# EasyEDA Pro project Tps7A47_Tps7A33.eprj

# Schematic Schematic1
Create Date: 2024-03-18; Page Name: P1; Project Name: Tps7A47_Tps7A33; Schematic Name: Schematic1; Update Date: 2024-03-27; Company: CUIT; Drawed: lcx; Page Size: A3; Version: V1.0
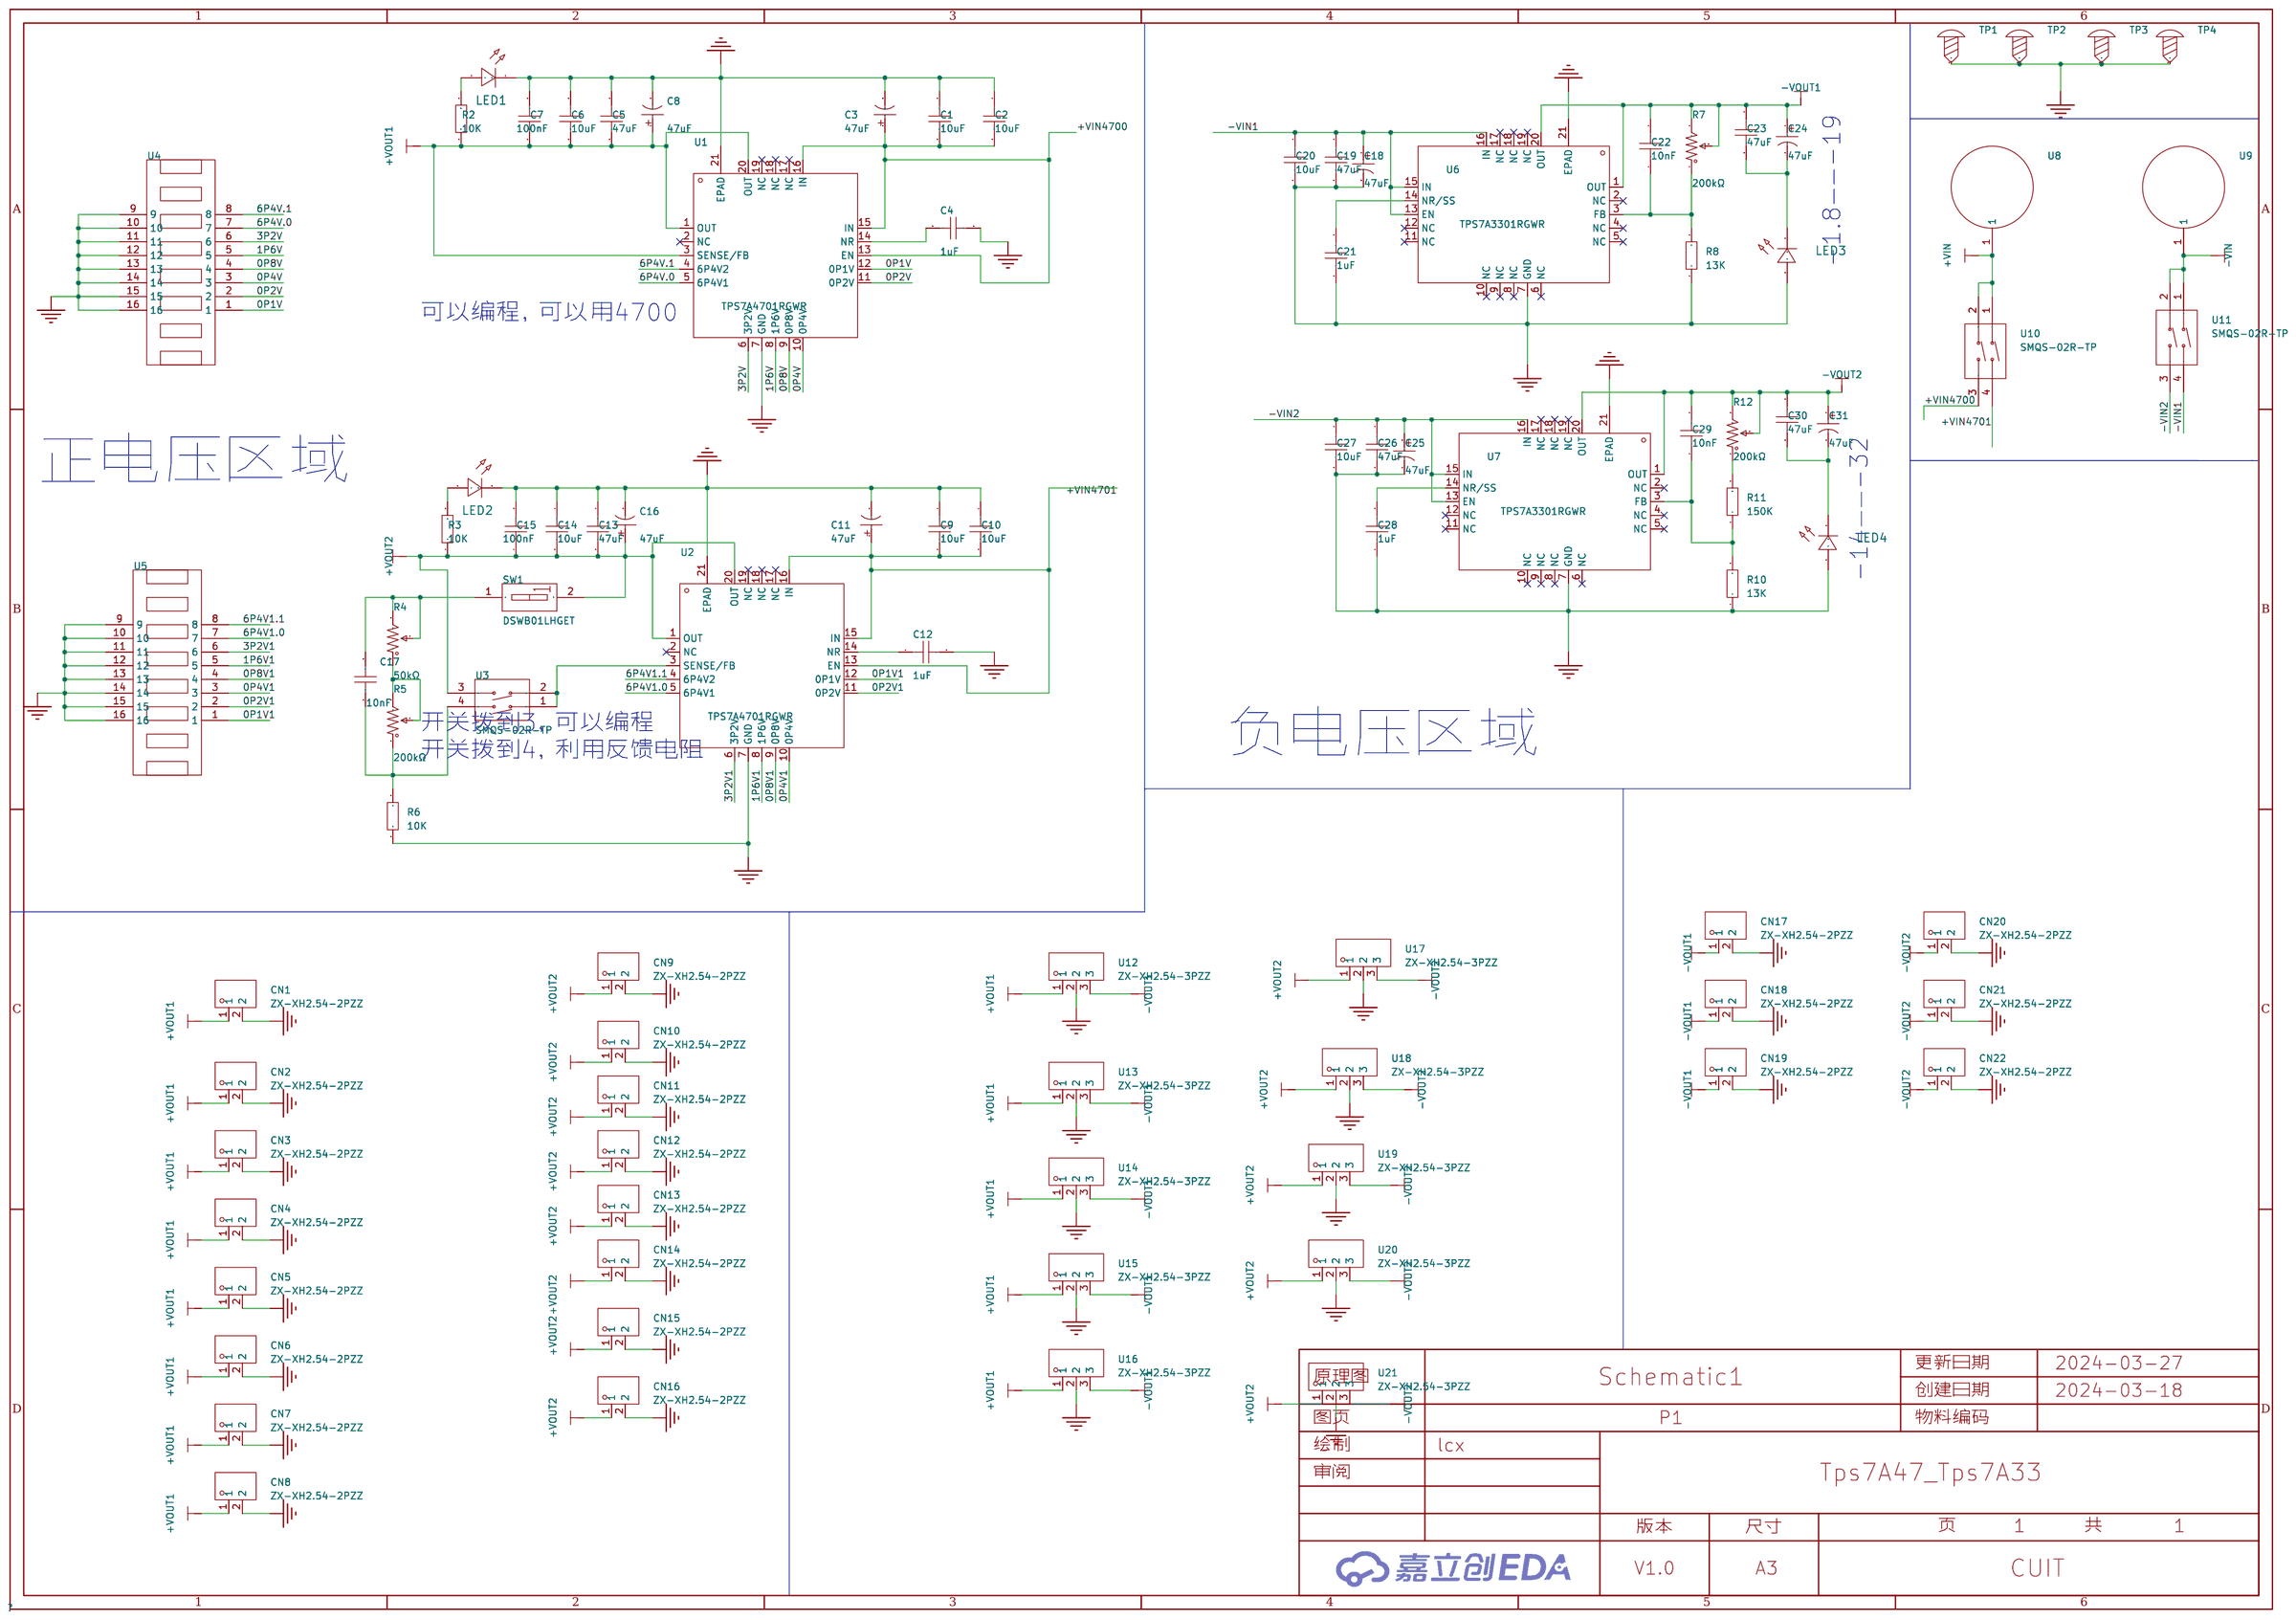
[diagram p0: schematic sheet]

## Parts
C1  10uF  [C1206]
C2  10uF  [C1206]
C3  47uF  [CAP-SMD_BD6.3-L6.6-W6.6-LS7.6-FD]
C4  1uF  [C1206]
C5  47uF  [C1206]
C6  10uF  [C1206]
C7  100nF  [C0805]
C8  47uF  [CAP-SMD_BD6.3-L6.6-W6.6-LS7.6-FD]
C9  10uF  [C1206]
C10  10uF  [C1206]
C11  47uF  [CAP-SMD_BD6.3-L6.6-W6.6-LS7.6-FD]
C12  1uF  [C1206]
C13  47uF  [C1206]
C14  10uF  [C1206]
C15  100nF  [C0805]
C16  47uF  [CAP-SMD_BD6.3-L6.6-W6.6-LS7.6-FD]
C17  10nF  [C0805]
C18  47uF  [CAP-SMD_BD6.3-L6.6-W6.6-LS7.6-FD]
C19  47uF  [C1206]
C20  10uF  [C1206]
C21  1uF  [C1206]
C22  10nF  [C0805]
C23  47uF  [C1206]
C24  47uF  [CAP-SMD_BD6.3-L6.6-W6.6-LS7.6-FD]
C25  47uF  [CAP-SMD_BD6.3-L6.6-W6.6-LS7.6-FD]
C26  47uF  [C1206]
C27  10uF  [C1206]
C28  1uF  [C1206]
C29  10nF  [C0805]
C30  47uF  [C1206]
C31  47uF  [CAP-SMD_BD6.3-L6.6-W6.6-LS7.6-FD]
CN1  ZX-XH2.54-2PZZ  [CONN-TH_2P-P2.50_HX25003-2A]
CN2  ZX-XH2.54-2PZZ  [CONN-TH_2P-P2.50_HX25003-2A]
CN3  ZX-XH2.54-2PZZ  [CONN-TH_2P-P2.50_HX25003-2A]
CN4  ZX-XH2.54-2PZZ  [CONN-TH_2P-P2.50_HX25003-2A]
CN5  ZX-XH2.54-2PZZ  [CONN-TH_2P-P2.50_HX25003-2A]
CN6  ZX-XH2.54-2PZZ  [CONN-TH_2P-P2.50_HX25003-2A]
CN7  ZX-XH2.54-2PZZ  [CONN-TH_2P-P2.50_HX25003-2A]
CN8  ZX-XH2.54-2PZZ  [CONN-TH_2P-P2.50_HX25003-2A]
CN9  ZX-XH2.54-2PZZ  [CONN-TH_2P-P2.50_HX25003-2A]
CN10  ZX-XH2.54-2PZZ  [CONN-TH_2P-P2.50_HX25003-2A]
CN11  ZX-XH2.54-2PZZ  [CONN-TH_2P-P2.50_HX25003-2A]
CN12  ZX-XH2.54-2PZZ  [CONN-TH_2P-P2.50_HX25003-2A]
CN13  ZX-XH2.54-2PZZ  [CONN-TH_2P-P2.50_HX25003-2A]
CN14  ZX-XH2.54-2PZZ  [CONN-TH_2P-P2.50_HX25003-2A]
CN15  ZX-XH2.54-2PZZ  [CONN-TH_2P-P2.50_HX25003-2A]
CN16  ZX-XH2.54-2PZZ  [CONN-TH_2P-P2.50_HX25003-2A]
CN17  ZX-XH2.54-2PZZ  [CONN-TH_2P-P2.50_HX25003-2A]
CN18  ZX-XH2.54-2PZZ  [CONN-TH_2P-P2.50_HX25003-2A]
CN19  ZX-XH2.54-2PZZ  [CONN-TH_2P-P2.50_HX25003-2A]
CN20  ZX-XH2.54-2PZZ  [CONN-TH_2P-P2.50_HX25003-2A]
CN21  ZX-XH2.54-2PZZ  [CONN-TH_2P-P2.50_HX25003-2A]
CN22  ZX-XH2.54-2PZZ  [CONN-TH_2P-P2.50_HX25003-2A]
LED1  -  [LED_0805]
LED2  -  [LED_0805]
LED3  -  [LED_0805]
LED4  -  [LED_0805]
R2  10K  [R0805]
R3  10K  [R0805]
R4  50kΩ  [RES-ADJ-TH_3P-L10.0-W10.0-P2.50-L]
R5  200kΩ  [RES-ADJ-TH_3P-L10.0-W10.0-P2.50-L]
R6  10K  [R0805]
R7  200kΩ  [RES-ADJ-TH_3P-L10.0-W10.0-P2.50-L]
R8  13K  [R0805]
R10  13K  [R0805]
R11  150K  [R0805]
R12  200kΩ  [RES-ADJ-TH_3P-L10.0-W10.0-P2.50-L]
SW1  DSWB01LHGET  [SW-TH_DSWB01LHGET]
TP1  -  [M2螺丝]
TP2  -  [M2螺丝]
TP3  -  [M2螺丝]
TP4  -  [M2螺丝]
U1  TPS7A4701RGWR  [VQFN-20_L5.0-W5.0-P0.65-TL-EP]
U2  TPS7A4701RGWR  [VQFN-20_L5.0-W5.0-P0.65-TL-EP]
U3  SMQS-02R-TP  [SW-TH_4P-L9.9-W6.8-P7.62-BL]
U4  -  [DIP16]
U5  -  [DIP16]
U6  TPS7A3301RGWR  [VQFN-20_L5.0-W5.0-P0.65-TL-EP]
U7  TPS7A3301RGWR  [VQFN-20_L5.0-W5.0-P0.65-TL-EP]
U8  -  [插座]
U9  -  [插座]
U10  SMQS-02R-TP  [SW-TH_4P-L9.9-W6.8-P7.62-BL]
U11  SMQS-02R-TP  [SW-TH_4P-L9.9-W6.8-P7.62-BL]
U12  ZX-XH2.54-3PZZ  [CONN-TH_3P-P2.54_2501S-3P]
U13  ZX-XH2.54-3PZZ  [CONN-TH_3P-P2.54_2501S-3P]
U14  ZX-XH2.54-3PZZ  [CONN-TH_3P-P2.54_2501S-3P]
U15  ZX-XH2.54-3PZZ  [CONN-TH_3P-P2.54_2501S-3P]
U16  ZX-XH2.54-3PZZ  [CONN-TH_3P-P2.54_2501S-3P]
U17  ZX-XH2.54-3PZZ  [CONN-TH_3P-P2.54_2501S-3P]
U18  ZX-XH2.54-3PZZ  [CONN-TH_3P-P2.54_2501S-3P]
U19  ZX-XH2.54-3PZZ  [CONN-TH_3P-P2.54_2501S-3P]
U20  ZX-XH2.54-3PZZ  [CONN-TH_3P-P2.54_2501S-3P]
U21  ZX-XH2.54-3PZZ  [CONN-TH_3P-P2.54_2501S-3P]

## Library data of the parts
C1 C2 C4-C6 C9 C10 C12-C14 C19-C21 C23 C26-C28 C30 = CAP_1206: Supplier Footprint: 1206
C3 C8 C11 C16 C18 C24 C25 C31 = RVT1H470M0607_C72523: 容值:47uF;精度:±20%;额定电压:50V;纹波电流:66mA@120Hz;等效串联电阻:-;; LCSC Part Name: 47uF ±20% 50V; Supplier Part: C72523; Manufacturer: ROQANG(容强); Manufacturer Part: RVT1H470M0607; Supplier Footprint: SMD,D6.3xL7.7mm; JLCPCB Part Class: 扩展库; Datasheet: https://atta.szlcsc.com/upload/public/pdf/source/20170325/1490427950282.pdf; Supplier: LCSC; Tolerance: ±20%; Rated Voltage: 50V; Ripple Current: 66mA@120Hz; φD: 6.3mm; L: 7.7mm; Lifetime @ Temp: 2000hrs@105℃; Operating Temperature: -40℃~+105℃
C7 C15 C17 C22 C29 = CAP_0805: Supplier Footprint: 0805
CN1-CN22 = ZX-XH2.54-2PZZ: 插针结构:1x2P;间距:2.54mm;安装方式:直插;参考系列:XH;总PIN数:2P;排数:1;每排PIN数:2;行距:-;额定电流:3A;触头材质:黄铜;触头镀层:锡;工作温度范围:-25℃~+85℃;; Supplier Part: C7429632; Manufacturer: Megastar(兆星); Supplier Footprint: 插件,P=2.54mm; JLCPCB Part Class: 扩展库; Datasheet: https://atta.szlcsc.com/upload/public/pdf/source/20230619/19BA6947230AA44A04D3EDD65E618FD0.pdf; Supplier: LCSC; Pins Structure: 1x2P; Pitch: 2.54mm; Mounting Style: 直插; Reference Series: XH; Number of Pins: 2P; Number of Rows: 1; Number of PINs Per Row: 2; Current Rating (Max): 3A; Contact Material: 黄铜; Contact Plating: 锡; Operating Temperature Range: -25℃~+85℃
LED1-LED4 = LED_0805-R: Supplier Footprint: 0805
R2 R3 R6 R8 R10 R11 = Res_0805: Supplier Footprint: 0805
R4 R5 R7 R12 = 3296W-1-103: 阻值:10kΩ;精度:±10%;; LCSC Part Name: 10kΩ ±10%; Supplier Part: C118954; Manufacturer: BOCHEN(博晨); Supplier Footprint: 插件; JLCPCB Part Class: 扩展库; Datasheet: https://atta.szlcsc.com/upload/public/pdf/source/20171114/C118954_15106326646611117443.pdf; Supplier: LCSC; Tolerance: ±10%
SW1 = DSWB01LHGET: 类型:平拨,凸起式;电路结构:单刀单掷;开关位数:1位;使用寿命:-;颜色:红色;; LCSC Part Name: 红色宽体1位顶拨插件; Supplier Part: C126888; Manufacturer: YE; Supplier Footprint: 插件; JLCPCB Part Class: Extended Part; Datasheet: https://atta.szlcsc.com/upload/public/pdf/source/20230725/F7B8293913D6FA08E6AB3369271AF82D.pdf; Supplier: LCSC; Type: 平拨,凸起式; Circuit: 单刀单掷; Number of Positions: 1位; Color: 红色
TP1-TP4 = M2螺丝: Supplier Footprint: 插件
U1 U2 = TPS7A4701RGWR: 输出类型:可调;最大输入电压:35V;输出电压:1.4V~34V;最大输出电流:1A;电源纹波抑制比(PSRR):78dB@(1kHz);输出极性:正极;; LCSC Part Name: ADJ 输入35V 输出1.4V~34V 1A; Supplier Part: C90084; Manufacturer: TI(德州仪器); Supplier Footprint: VQFN-20-EP(5x5); JLCPCB Part Class: Extended Part; Datasheet: https://www.ti.com/cn/lit/gpn/tps7a47; Supplier: LCSC; Output Type: 可调; Maximum Input Voltage: 35V; Output Voltage: 1.4V~34V; MAX Output Current: 1A; Power Supply Rejection Ratio (PSRR): 78dB@(1kHz); Dropout Voltage: 450mV@(1A); standby current: 1mA; Noise: 4.67uVrms; Feature: 过流保护；使能；过热保护; Output Polarity: 正极; Number of Outputs: 1
U3 U10 U11 = SMQS-02R-TP: 类型:平拨,凸起式;电路结构:-;开关位数:2位;额定电流:-;额定电压:-;使用寿命:5千次;颜色:红色;; LCSC Part Name: 间距2.54mm 平拨,凸起式2位拨码开关; Supplier Part: C5299503; Manufacturer: SM Switch; JLCPCB Part Class: Extended Part; Datasheet: https://atta.szlcsc.com/upload/public/pdf/source/20230428/BECBF613F67C0CF733CC6E01F0CA4E67.pdf; Supplier: LCSC; Type: 平拨,凸起式; Number of Positions: 2位; Lead Pitch: 2.54mm; Operating Temperature: -40℃~+85℃; Operating Life: 5千次; Color: 红色
U4 U5 = 八位拨码开关
U6 U7 = TPS7A3301RGWR: 输出类型:可调;最大输入电压:36V;输出电压:1.18V~33V;最大输出电流:1A;电源纹波抑制比(PSRR):72dB@(10kHz);输出极性:负极;; LCSC Part Name: ADJ 输入36V 输出1.18V~33V 1A; Supplier Part: C90082; Manufacturer: TI(德州仪器); Supplier Footprint: VQFN-20-EP(5x5); JLCPCB Part Class: Extended Part; Datasheet: https://www.ti.com/cn/lit/gpn/tps7a33; Supplier: LCSC; Output Type: 可调; Maximum Input Voltage: 36V; Output Voltage: 1.18V~33V; MAX Output Current: 1A; Power Supply Rejection Ratio (PSRR): 72dB@(10kHz); Dropout Voltage: 800mV@(1A); Output Polarity: 负极; Number of Outputs: 1
U8 U9 = 4mmbananaheader
U12-U21 = ZX-XH2.54-3PZZ: 插针结构:1x3P;间距:2.54mm;安装方式:直插;参考系列:XH;总PIN数:3P;排数:1;每排PIN数:3;行距:-;额定电流:3A;触头材质:黄铜;触头镀层:锡;工作温度范围:-25℃~+85℃;; Supplier Part: C7429633; Manufacturer: Megastar(兆星); Supplier Footprint: 插件,P=2.54mm; JLCPCB Part Class: 扩展库; Datasheet: https://atta.szlcsc.com/upload/public/pdf/source/20230619/AE17037A2CFDBE8D9CBA775D61AD0A84.pdf; Supplier: LCSC; Pins Structure: 1x3P; Pitch: 2.54mm; Mounting Style: 直插; Reference Series: XH; Number of Pins: 3P; Number of Rows: 1; Number of PINs Per Row: 3; Current Rating (Max): 3A; Contact Material: 黄铜; Contact Plating: 锡; Operating Temperature Range: -25℃~+85℃

## Nets
+VIN: U8.1 U10.1 U10.2
+VIN4700: C1.2 C2.2 C3.1 U1.13(EN) U1.15(IN) U1.16(IN) U10.3
+VIN4701: C9.2 C10.2 C11.1 U2.13(EN) U2.15(IN) U2.16(IN) U10.4
-VIN: U9.1 U11.1 U11.2
-VIN1: C18.1 C19.1 C20.1 U6.13(EN) U6.15(IN) U6.16(IN) U11.4
-VIN2: C25.1 C26.1 C27.1 U7.13(EN) U7.15(IN) U7.16(IN) U11.3
GND: C1.1 C2.1 C3.2 C4.2 C5.1 C6.1 C7.2 C8.2 C9.1 C10.1 C11.2 C12.2 C13.1 C14.1 C15.2 C16.2 C18.2 C19.2 C20.2 C21.1 C25.2 C26.2 C27.2 C28.1 CN1.2 CN2.2 CN3.2 CN4.2 CN5.2 CN6.2 CN7.2 CN8.2 CN9.2 CN10.2 CN11.2 CN12.2 CN13.2 CN14.2 CN15.2 CN16.2 CN17.2 CN18.2 CN19.2 CN20.2 CN21.2 CN22.2 LED1.1(C) LED2.1(C) LED3.2(A) LED4.2(A) R6.1 R8.1 R10.1 TP1.1 TP2.1 TP3.1 TP4.1 U1.7(GND) U1.21(EPAD) U2.7(GND) U2.21(EPAD) U4.9 U4.10 U4.11 U4.12 U4.13 U4.14 U4.15 U4.16 U5.9 U5.10 U5.11 U5.12 U5.13 U5.14 U5.15 U5.16 U6.7(GND) U6.21(EPAD) U7.7(GND) U7.21(EPAD) U12.2 U13.2 U14.2 U15.2 U16.2 U17.2 U18.2 U19.2 U20.2 U21.2
0P1V: U1.12(0P1V) U4.1
0P1V1: U2.12(0P1V) U5.1
0P2V: U1.11(0P2V) U4.2
0P2V1: U2.11(0P2V) U5.2
0P4V: U1.10(0P4V) U4.3
0P4V1: U2.10(0P4V) U5.3
0P8V: U1.9(0P8V) U4.4
0P8V1: U2.9(0P8V) U5.4
1P6V: U1.8(1P6V) U4.5
1P6V1: U2.8(1P6V) U5.5
3P2V: U1.6(3P2V) U4.6
3P2V1: U2.6(3P2V) U5.6
6P4V1.0: U2.5(6P4V1) U5.7
6P4V1.1: U2.4(6P4V2) U5.8
6P4V.0: U1.5(6P4V1) U4.7
6P4V.1: U1.4(6P4V2) U4.8
+VOUT1: C5.2 C6.2 C7.1 C8.1 CN1.1 CN2.1 CN3.1 CN4.1 CN5.1 CN6.1 CN7.1 CN8.1 R2.1 U1.1(OUT) U1.3(SENSE/FB) U1.20(OUT) U12.1 U13.1 U14.1 U15.1 U16.1
+VOUT2: C13.2 C14.2 C15.1 C16.1 CN9.1 CN10.1 CN11.1 CN12.1 CN13.1 CN14.1 CN15.1 CN16.1 R3.1 SW1.2 U2.1(OUT) U2.20(OUT) U3.3 U17.1 U18.1 U19.1 U20.1 U21.1
-VOUT1: C22.2 C23.1 C24.1 CN17.1 CN18.1 CN19.1 R7.2 R7.3 U6.1(OUT) U6.20(OUT) U12.3 U13.3 U14.3 U15.3 U16.3
-VOUT2: C29.2 C30.1 C31.1 CN20.1 CN21.1 CN22.1 R12.2 R12.3 U7.1(OUT) U7.20(OUT) U17.3 U18.3 U19.3 U20.3 U21.3
$1N1706: C4.1 U1.14(NR)
$1N2508: LED1.2(A) R2.2
$1N3698: C12.1 U2.14(NR)
$1N3720: LED2.2(A) R3.2
$1N4132: R4.1 R5.2 R5.3
$1N4373: U2.3(SENSE/FB) U3.1 U3.2
$1N4467: C17.1 R5.1 R6.2 U3.4
$1N5088: C21.2 U6.14(NR/SS)
$1N5429: C22.1 R7.1 R8.2 U6.3(FB)
$1N6070: C29.1 R10.2 R11.1 U7.3(FB)
$1N6091: C28.2 U7.14(NR/SS)
$1N6218: R11.2 R12.1
$1N6336: C23.2 C24.2 LED3.1(C)
$1N6350: C30.2 C31.2 LED4.1(C)
$1N8256: C17.2 R4.2 R4.3 SW1.1(A1)

Not connected (* = marked no-connect by the designer): U1 2(NC)* 17(NC)* 18(NC)* 19(NC)*; U2 2(NC)* 17(NC)* 18(NC)* 19(NC)*; U6 2(NC)* 4(NC)* 5(NC)* 6(NC)* 8(NC)* 9(NC)* 10(NC)* 11(NC)* 12(NC)* 17(NC)* 18(NC)* 19(NC)*; U7 2(NC)* 4(NC)* 5(NC)* 6(NC)* 8(NC)* 9(NC)* 10(NC)* 11(NC)* 12(NC)* 17(NC)* 18(NC)* 19(NC)*

## Notes on the sheet
- -1.8——-19
- 可以编程，可以用4700
- 正电压区域
- -14——-32
- 开关拨到3，可以编程
  开关拨到4，利用反馈电阻
- 负电压区域

# Board PCB1
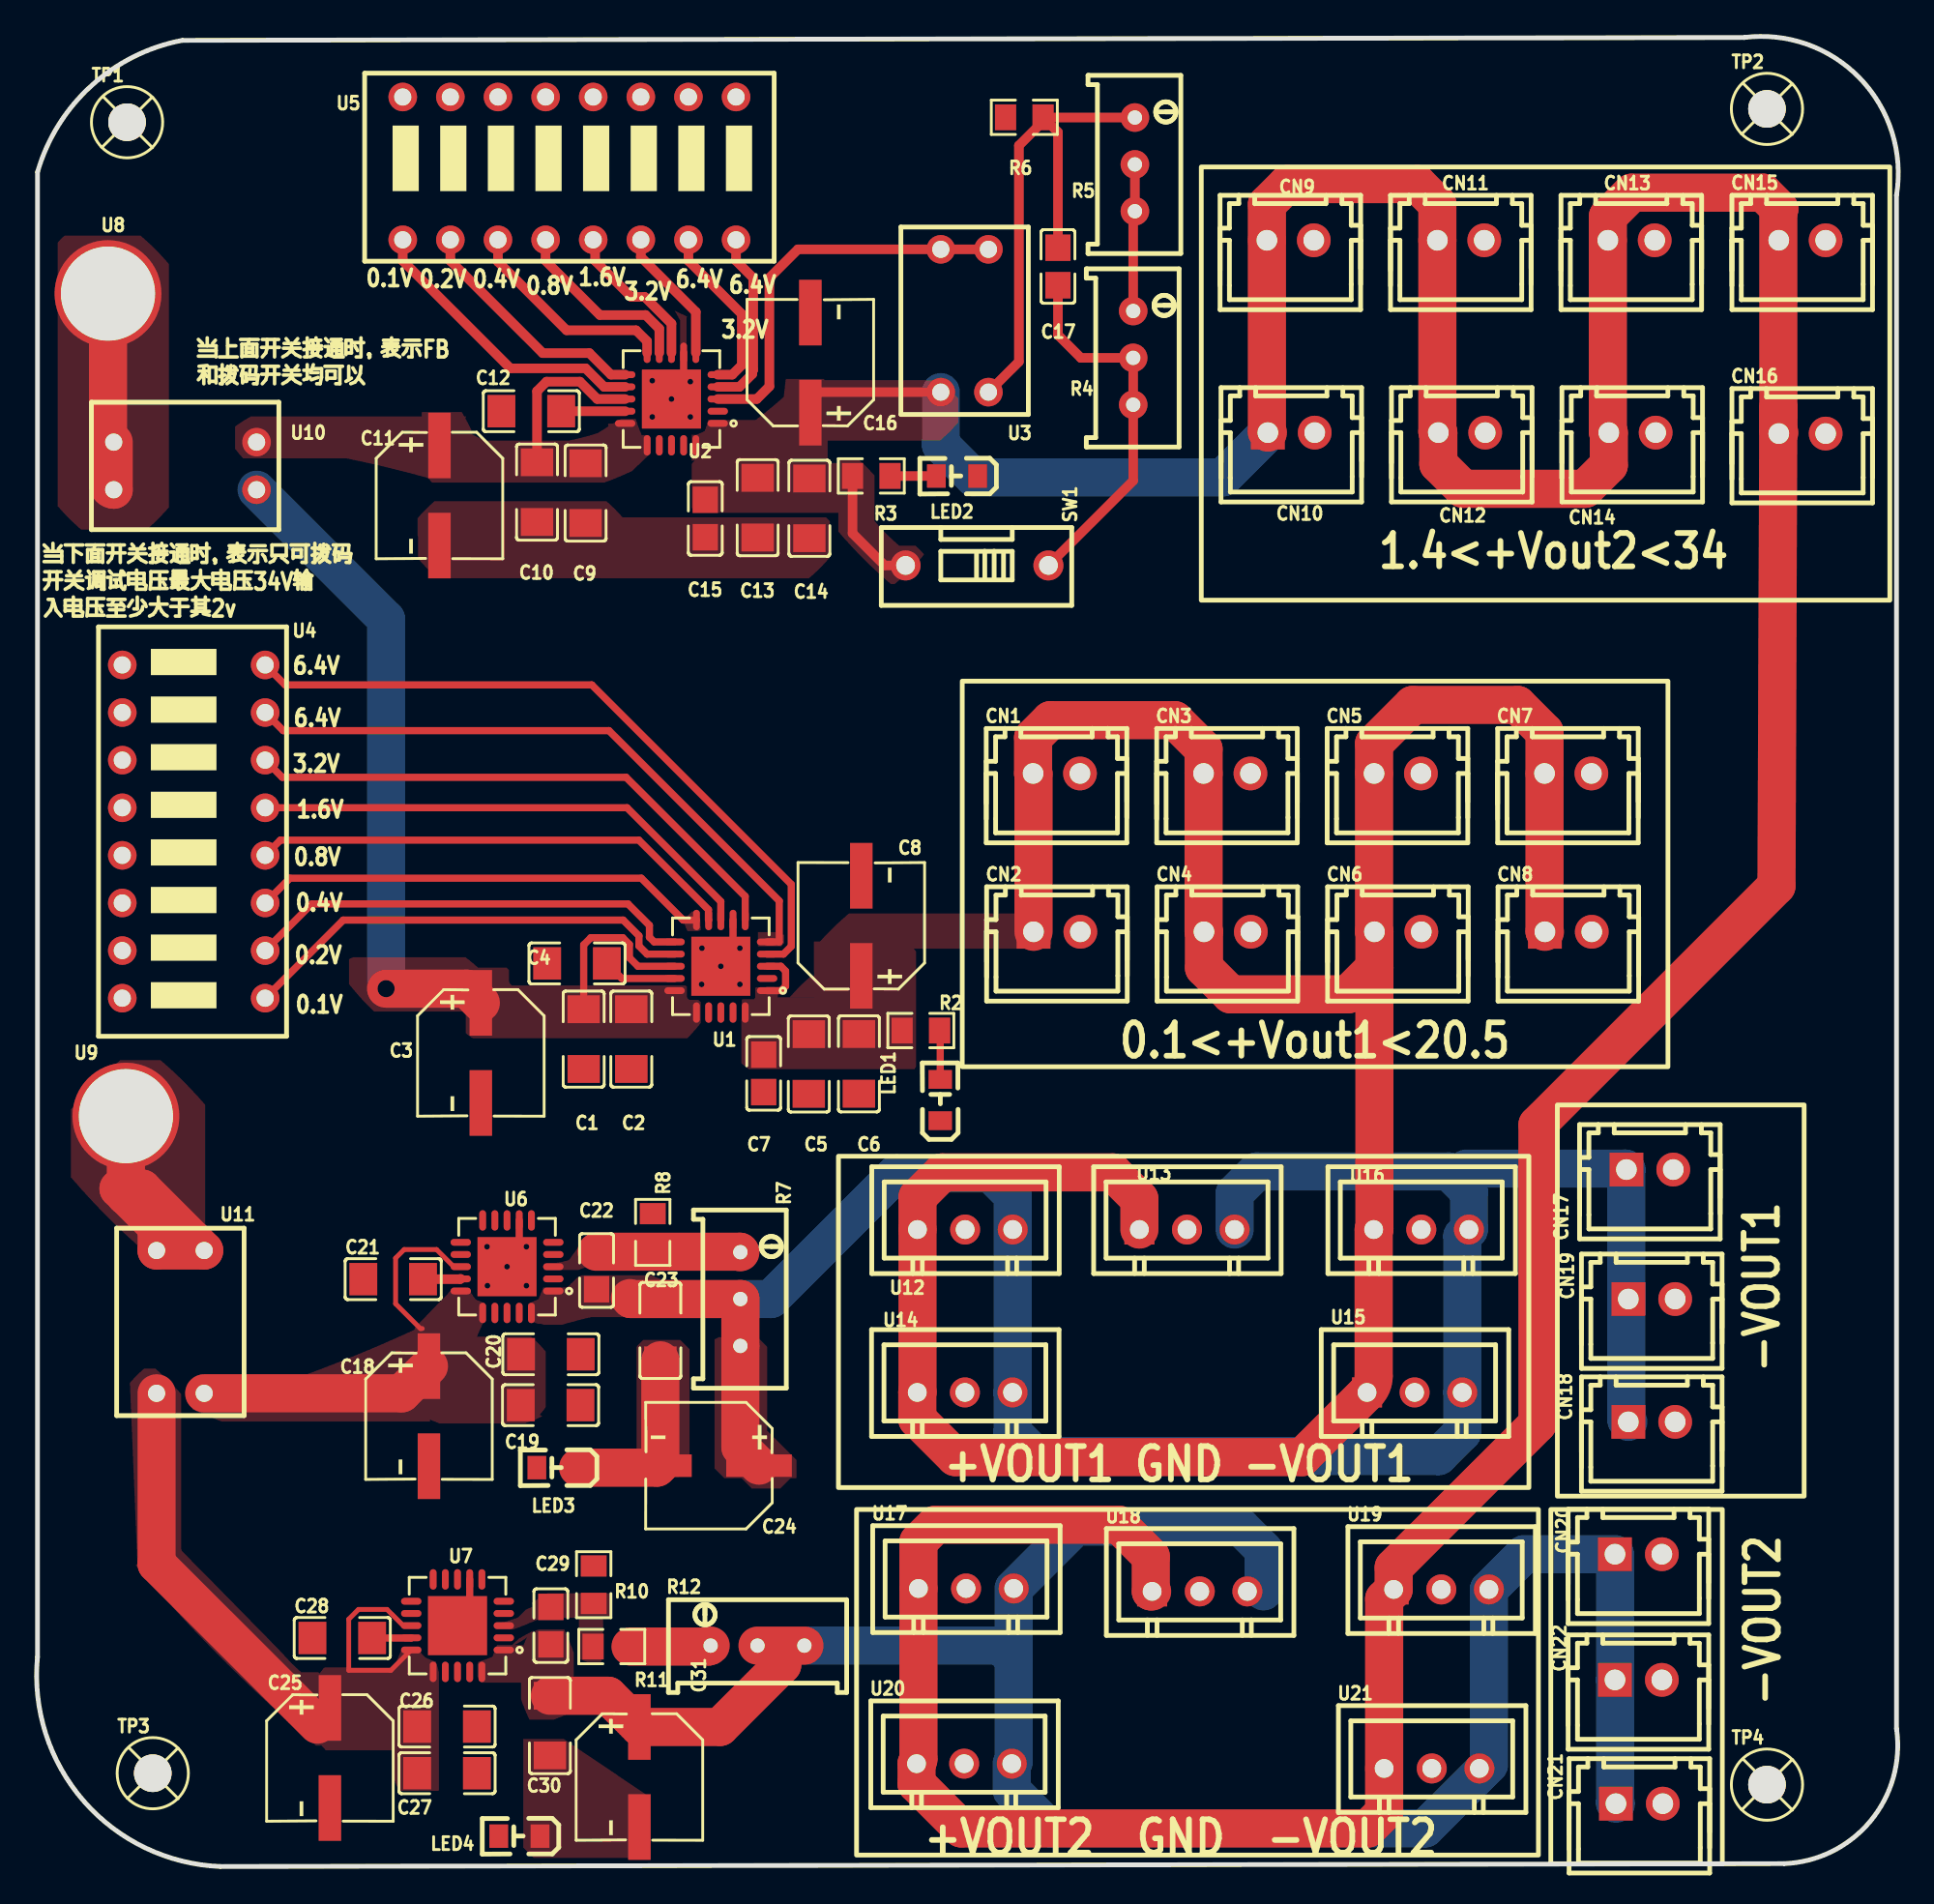
[diagram p1: board, top side]
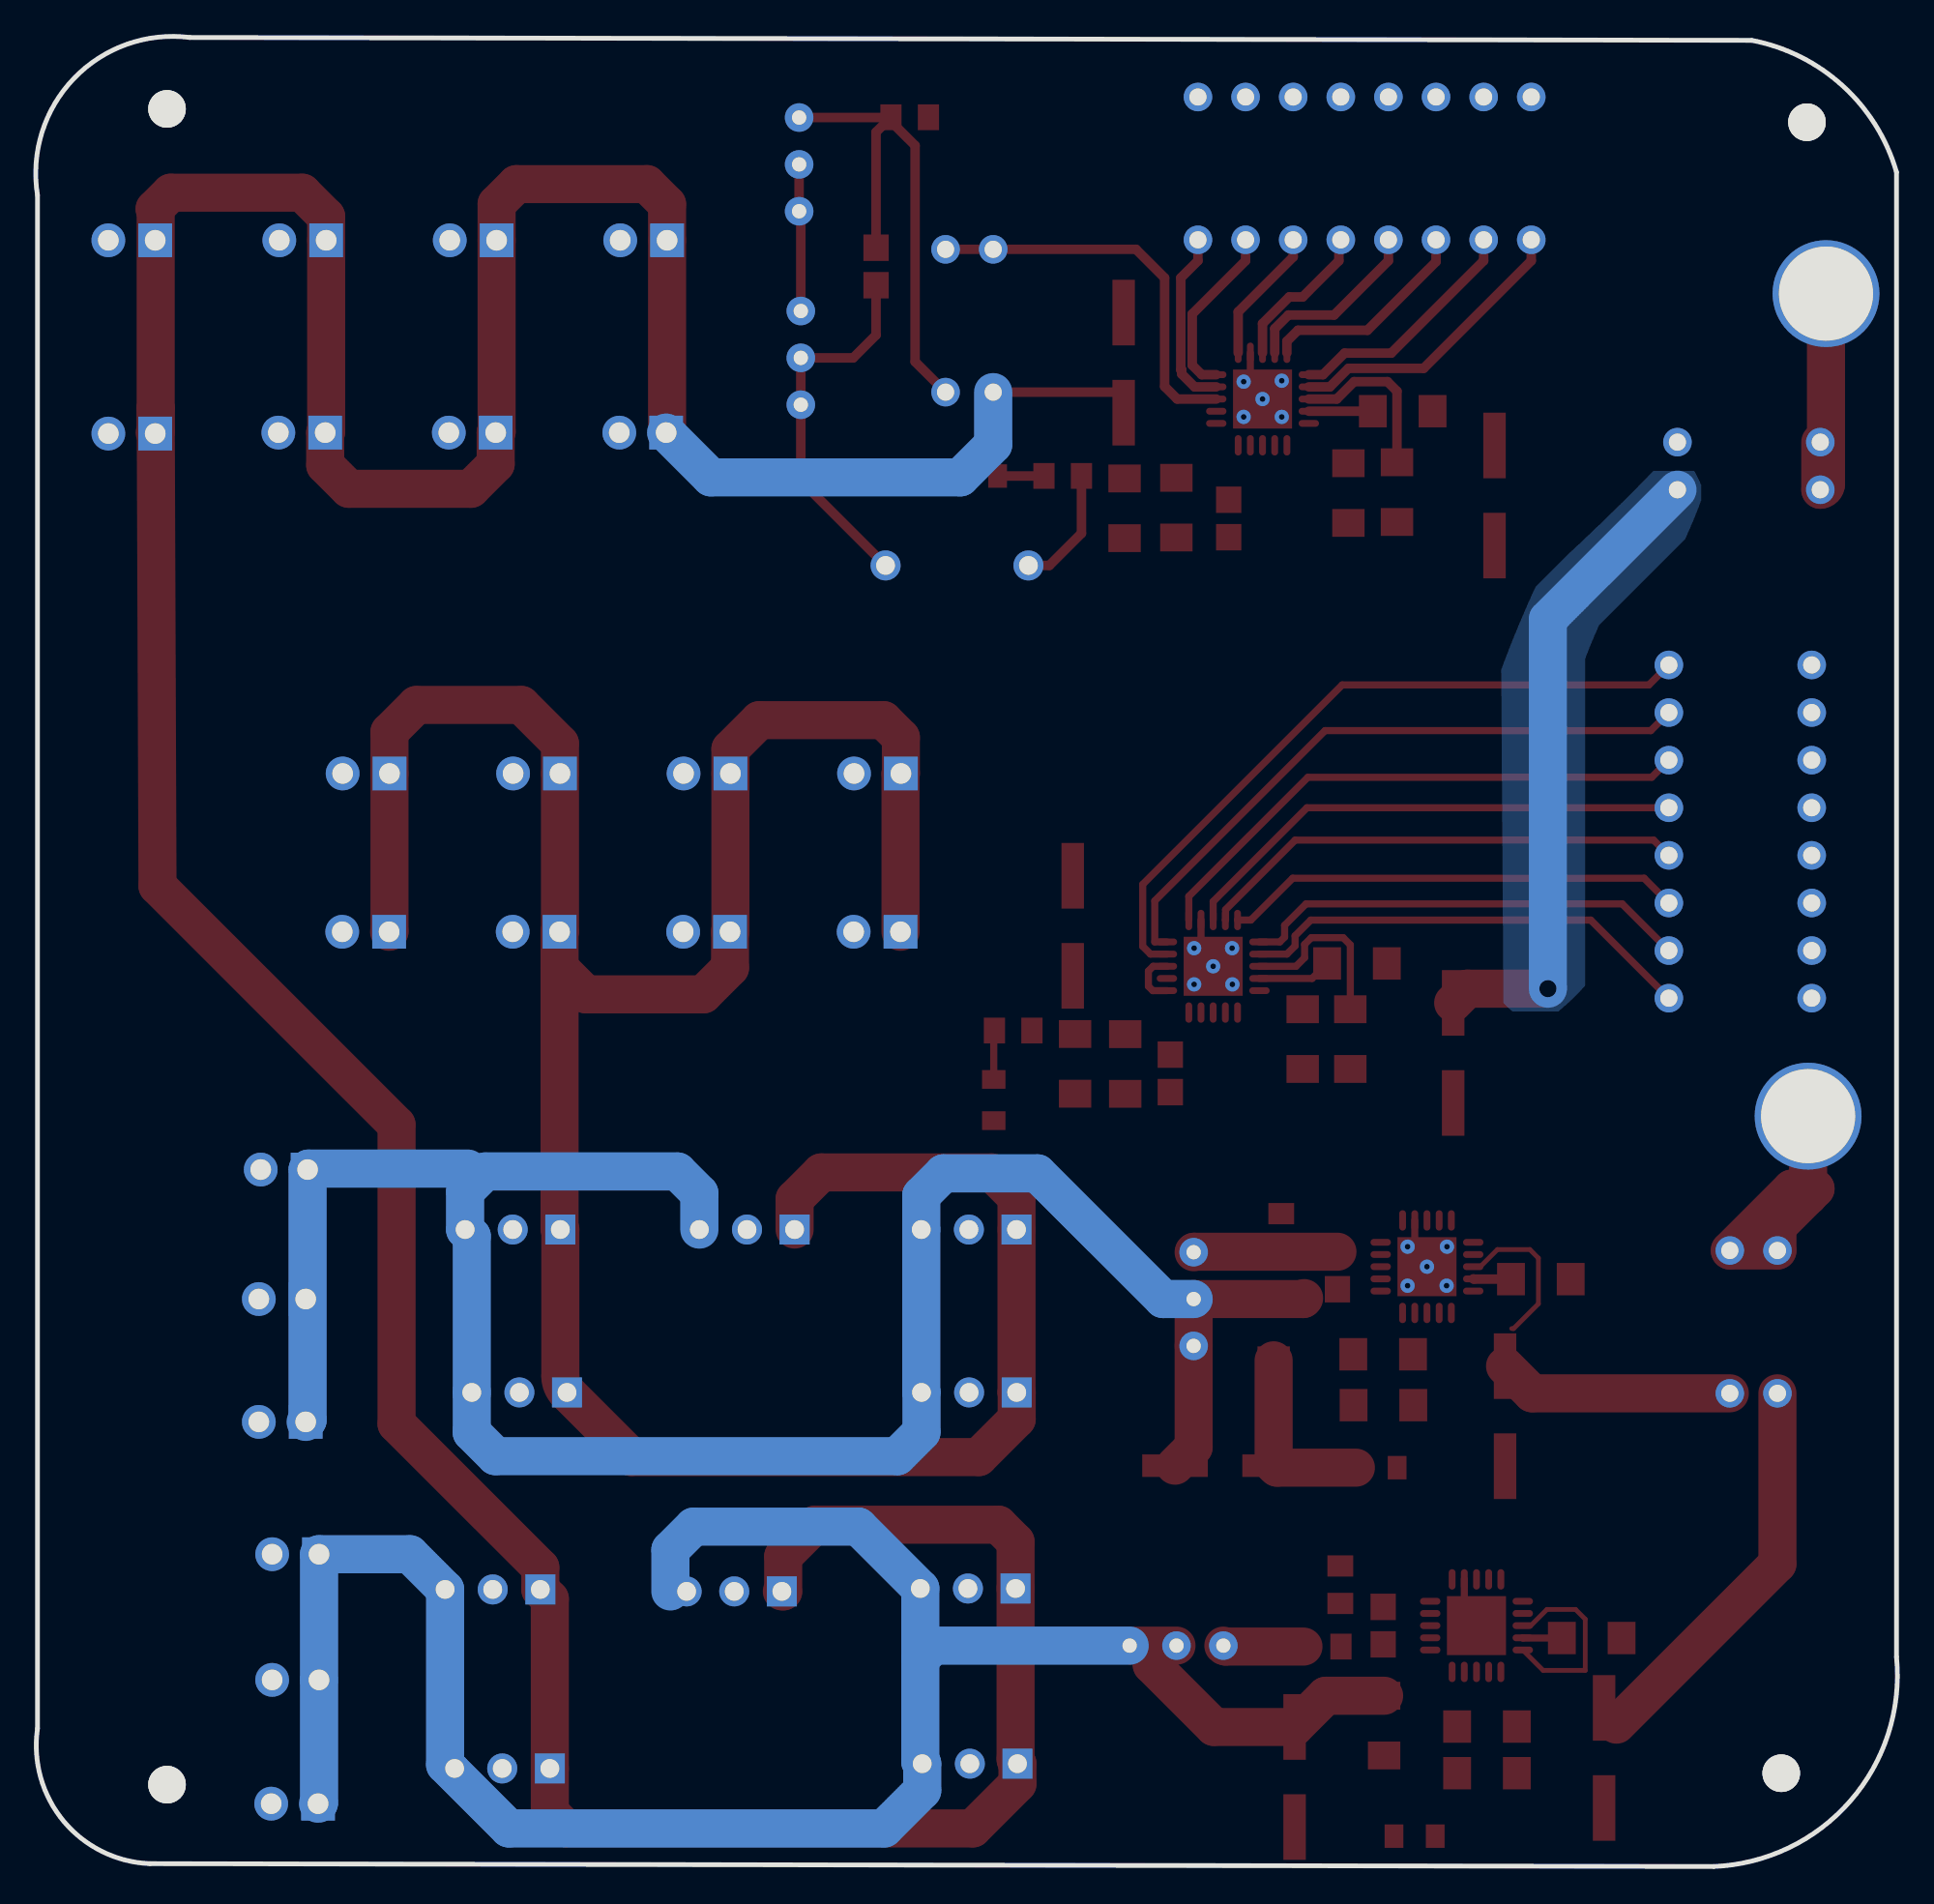
[diagram p2: board, bottom side, seen from below]

Outline 99.16 x 97.59 mm; copper layers: Top Layer, Bottom Layer. Coordinates in mm from the lower left corner of the outline.
Outline path: 0,90.4 arc(2.87,95.01) 7.72,97.43 91.04,97.59 arc(97.21,95.41) 99.16,89.17 99.16,7.36 arc(97.77,2.42) 93.17,0.15 9.76,0 arc(2.47,3.49) 0,11.18 0,90.4
Stack: Top Layer 0.035mm / Dielectric1 1.51mm FR4 er 4.5 / Bottom Layer 0.035mm

## Design rules (mm)
template: JLCPCB Capability(Two Layers Board)
spacing copperThickness1oz (default): track to track 0.102, other pairs 0.152 to 0.3
spacing copperThickness2oz: track to track 0.203, other pairs 0.152 to 0.3
track width copperThickness1oz (default): min 0.127, default 0.254, max 2.54
track width copperThickness2oz: min 0.203, default 0.254, max 2.54
differential pair differentialPair (default): width min 0.127, default 0.254, max 2.54; gap min 0.152, default 0.152
via viaSize (default): diameter min 0.5, default 0.61, max 10; hole min 0.3, default 0.305, max 6.3

## Placement (name value [footprint] x y rotation side)
C1  10uF  [C1206]  29.13 44.15 90 top
C2  10uF  [C1206]  31.68 44.15 90 top
C3  47uF  [CAP-SMD_BD6.3-L6.6-W6.6-LS7.6-FD]  23.65 43.41 270 top
C4  1uF  [C1206]  28.78 48.18 180 top
C5  47uF  [C1206]  41.14 42.82 90 top
C6  10uF  [C1206]  43.82 42.83 90 top
C7  100nF  [C0805]  38.74 42.32 270 top
C8  47uF  [CAP-SMD_BD6.3-L6.6-W6.6-LS7.6-FD]  43.94 50.19 90 top
C9  10uF  [C1206]  29.24 73.28 90 top
C10  10uF  [C1206]  26.65 73.33 90 top
C11  47uF  [CAP-SMD_BD6.3-L6.6-W6.6-LS7.6-FD]  21.44 73.15 270 top
C12  1uF  [C1206]  26.34 77.65 180 top
C13  47uF  [C1206]  38.41 72.5 90 top
C14  10uF  [C1206]  41.18 72.47 90 top
C15  100nF  [C0805]  35.62 71.92 270 top
C16  47uF  [CAP-SMD_BD6.3-L6.6-W6.6-LS7.6-FD]  41.23 80.24 90 top
C17  10nF  [C0805]  54.43 85.37 270 top
C18  47uF  [CAP-SMD_BD6.3-L6.6-W6.6-LS7.6-FD]  20.88 24.03 270 top
C19  47uF  [C1206]  27.37 24.62 0 top
C20  10uF  [C1206]  27.38 27.33 0 top
C21  1uF  [C1206]  18.97 31.34 0 top
C22  10nF  [C0805]  29.82 31.8 270 top
C23  47uF  [C1206]  33.23 28.6 270 top
C24  47uF  [CAP-SMD_BD6.3-L6.6-W6.6-LS7.6-FD]  35.82 21.39 180 top
C25  47uF  [CAP-SMD_BD6.3-L6.6-W6.6-LS7.6-FD]  15.6 5.79 270 top
C26  47uF  [C1206]  21.85 7.47 0 top
C27  10uF  [C1206]  21.85 4.98 0 top
C28  1uF  [C1206]  16.26 12.19 0 top
C29  10nF  [C0805]  27.38 12.85 270 top
C30  47uF  [C1206]  27.33 7.52 270 top
C31  47uF  [CAP-SMD_BD6.3-L6.6-W6.6-LS7.6-FD]  32.11 4.78 270 top
CN1  ZX-XH2.54-2PZZ  [CONN-TH_2P-P2.50_HX25003-2A]  54.36 58.32 0 top
CN2  ZX-XH2.54-2PZZ  [CONN-TH_2P-P2.50_HX25003-2A]  54.38 49.87 0 top
CN3  ZX-XH2.54-2PZZ  [CONN-TH_2P-P2.50_HX25003-2A]  63.45 58.32 0 top
CN4  ZX-XH2.54-2PZZ  [CONN-TH_2P-P2.50_HX25003-2A]  63.47 49.87 0 top
CN5  ZX-XH2.54-2PZZ  [CONN-TH_2P-P2.50_HX25003-2A]  72.54 58.32 0 top
CN6  ZX-XH2.54-2PZZ  [CONN-TH_2P-P2.50_HX25003-2A]  72.57 49.87 0 top
CN7  ZX-XH2.54-2PZZ  [CONN-TH_2P-P2.50_HX25003-2A]  81.64 58.32 0 top
CN8  ZX-XH2.54-2PZZ  [CONN-TH_2P-P2.50_HX25003-2A]  81.66 49.87 0 top
CN9  ZX-XH2.54-2PZZ  [CONN-TH_2P-P2.50_HX25003-2A]  66.83 86.77 0 top
CN10  ZX-XH2.54-2PZZ  [CONN-TH_2P-P2.50_HX25003-2A]  66.88 76.5 0 top
CN11  ZX-XH2.54-2PZZ  [CONN-TH_2P-P2.50_HX25003-2A]  75.92 86.77 0 top
CN12  ZX-XH2.54-2PZZ  [CONN-TH_2P-P2.50_HX25003-2A]  75.97 76.5 0 top
CN13  ZX-XH2.54-2PZZ  [CONN-TH_2P-P2.50_HX25003-2A]  85.02 86.77 0 top
CN14  ZX-XH2.54-2PZZ  [CONN-TH_2P-P2.50_HX25003-2A]  85.07 76.5 0 top
CN15  ZX-XH2.54-2PZZ  [CONN-TH_2P-P2.50_HX25003-2A]  94.13 86.77 0 top
CN16  ZX-XH2.54-2PZZ  [CONN-TH_2P-P2.50_HX25003-2A]  94.13 76.45 0 top
CN17  ZX-XH2.54-2PZZ  [CONN-TH_2P-P2.50_HX25003-2A]  86.01 37.19 0 top
CN18  ZX-XH2.54-2PZZ  [CONN-TH_2P-P2.50_HX25003-2A]  86.11 23.72 0 top
CN19  ZX-XH2.54-2PZZ  [CONN-TH_2P-P2.50_HX25003-2A]  86.11 30.28 0 top
CN20  ZX-XH2.54-2PZZ  [CONN-TH_2P-P2.50_HX25003-2A]  85.4 16.66 0 top
CN21  ZX-XH2.54-2PZZ  [CONN-TH_2P-P2.50_HX25003-2A]  85.45 3.35 0 top
CN22  ZX-XH2.54-2PZZ  [CONN-TH_2P-P2.50_HX25003-2A]  85.4 9.96 0 top
LED1  -  [LED_0805]  48.16 40.94 90 top
LED2  -  [LED_0805]  49 74.19 180 top
LED3  -  [LED_0805]  27.69 21.29 180 top
LED4  -  [LED_0805]  25.66 1.63 180 top
R2  10K  [R0805]  47.12 44.6 0 top
R3  10K  [R0805]  44.48 74.19 0 top
R4  50kΩ  [RES-ADJ-TH_3P-L10.0-W10.0-P2.50-L]  58.45 80.49 270 top
R5  200kΩ  [RES-ADJ-TH_3P-L10.0-W10.0-P2.50-L]  58.54 90.82 270 top
R6  10K  [R0805]  52.64 93.33 0 top
R7  200kΩ  [RES-ADJ-TH_3P-L10.0-W10.0-P2.50-L]  37.49 30.28 270 top
R8  13K  [R0805]  32.82 33.83 270 top
R10  13K  [R0805]  29.67 15.04 270 top
R11  150K  [R0805]  30.63 11.74 0 top
R12  200kΩ  [RES-ADJ-TH_3P-L10.0-W10.0-P2.50-L]  38.41 11.79 0 top
SW1  DSWB01LHGET  [SW-TH_DSWB01LHGET]  50.12 69.42 270 top
TP1  -  [M2螺丝]  4.78 93.07 0 top
TP2  -  [M2螺丝]  92.25 93.78 0 top
TP3  -  [M2螺丝]  6.15 4.98 0 top
TP4  -  [M2螺丝]  92.25 4.37 0 top
U1  TPS7A4701RGWR  [VQFN-20_L5.0-W5.0-P0.65-TL-EP]  36.45 48.03 180 top
U2  TPS7A4701RGWR  [VQFN-20_L5.0-W5.0-P0.65-TL-EP]  33.82 78.3 180 top
U3  SMQS-02R-TP  [SW-TH_4P-L9.9-W6.8-P7.62-BL]  49.46 82.47 180 top
U4  -  [DIP16]  7.06 49.63 90 top
U5  -  [DIP16]  22.78 91.87 0 top
U6  TPS7A3301RGWR  [VQFN-20_L5.0-W5.0-P0.65-TL-EP]  25.05 32 180 top
U7  TPS7A3301RGWR  [VQFN-20_L5.0-W5.0-P0.65-TL-EP]  22.41 12.85 180 top
U8  -  [插座]  3.76 83.92 0 top
U9  -  [插座]  4.72 40.04 0 top
U10  SMQS-02R-TP  [SW-TH_4P-L9.9-W6.8-P7.62-BL]  7.88 74.73 270 top
U11  SMQS-02R-TP  [SW-TH_4P-L9.9-W6.8-P7.62-BL]  7.62 29.06 180 top
U12  ZX-XH2.54-3PZZ  [CONN-TH_3P-P2.54_2501S-3P]  49.48 33.99 0 top
U13  ZX-XH2.54-3PZZ  [CONN-TH_3P-P2.54_2501S-3P]  61.32 33.99 0 top
U14  ZX-XH2.54-3PZZ  [CONN-TH_3P-P2.54_2501S-3P]  49.47 25.3 0 top
U15  ZX-XH2.54-3PZZ  [CONN-TH_3P-P2.54_2501S-3P]  73.46 25.3 0 top
U16  ZX-XH2.54-3PZZ  [CONN-TH_3P-P2.54_2501S-3P]  73.81 33.99 0 top
U17  ZX-XH2.54-3PZZ  [CONN-TH_3P-P2.54_2501S-3P]  49.53 14.83 0 top
U18  ZX-XH2.54-3PZZ  [CONN-TH_3P-P2.54_2501S-3P]  62 14.68 0 top
U19  ZX-XH2.54-3PZZ  [CONN-TH_3P-P2.54_2501S-3P]  74.88 14.78 0 top
U20  ZX-XH2.54-3PZZ  [CONN-TH_3P-P2.54_2501S-3P]  49.43 5.49 0 top
U21  ZX-XH2.54-3PZZ  [CONN-TH_3P-P2.54_2501S-3P]  74.37 5.23 0 top

## Footprints (pads in the part's own frame, mm; a bottom-side part is the same pattern mirrored in y, then rotated)
C0805
  rect 1.41x1.35 smd: 1(-1,0) 2(1,0)
C1206
  rect 1.485x1.728 smd: 1(-1.593,0) 2(1.593,0)
CAP-SMD_BD6.3-L6.6-W6.6-LS7.6-FD
  rect 3.5x1.2 smd: 1(-2.67,0) 2(2.67,0)
CONN-TH_2P-P2.50_HX25003-2A
  rect 1.8x1.8 hole 1.1: 1(-1.25,0)
  round 1.8 hole 1.1: 2(1.25,0)
CONN-TH_3P-P2.54_2501S-3P
  rect 1.6x1.6 hole 1: 1(-2.54,0)
  round 1.6 hole 1: 2(0,0) 3(2.54,0)
DIP16
  round 1.524 hole 0.914: 1(-3.302,-5.08) 2(-0.762,-5.08) 3(1.778,-5.08) 4(4.318,-5.08) 5(6.858,-5.08) 6(9.398,-5.08) 7(11.938,-5.08) 8(14.478,-5.08) 9(-3.302,2.54) 10(-0.762,2.54) 11(1.778,2.54) 12(4.318,2.54) 13(6.858,2.54) 14(9.398,2.54) 15(11.938,2.54) 16(14.478,2.54)
LED_0805
  rect 1x1.25 smd: 1(-1.15,0.005) 2(1.05,0.005)
M2螺丝
  round 2 hole 2: 1(0,0)
R0805
  rect 1.133x1.377 smd: 1(-1,0) 2(1,0)
RES-ADJ-TH_3P-L10.0-W10.0-P2.50-L
  round 1.524 hole 0.762: 1(-2.5,0) 2(0,0) 3(2.5,0)
SW-TH_4P-L9.9-W6.8-P7.62-BL
  round 1.524 hole 0.914: 1(-1.27,-3.81) 2(1.27,-3.81) 3(1.27,3.81) 4(-1.27,3.81)
SW-TH_DSWB01LHGET
  round 1.6 hole 1: 1(0,3.81) 2(0,-3.81)
VQFN-20_L5.0-W5.0-P0.65-TL-EP
  oval 1.087x0.364 smd: 1(-2.469,1.3) 2(-2.469,0.65) 3(-2.469,0) 4(-2.469,-0.65) 5(-2.469,-1.3) 11(2.469,-1.3) 12(2.469,-0.65) 13(2.469,0) 14(2.469,0.65) 15(2.469,1.3)
  oval 0.364x1.087 smd: 6(-1.3,-2.469) 7(-0.65,-2.469) 8(0,-2.469) 9(0.65,-2.469) 10(1.3,-2.469) 16(1.3,2.469) 17(0.65,2.469) 18(0,2.469) 19(-0.65,2.469) 20(-1.3,2.469)
  rect 3.15x3.15 smd: 21(0,0)
插座
  round 5.7 hole 5.02x2.8: 1(0,0)

## Nets
As in the schematic.

Pads without a net: U1 2 17 18 19; U2 2 17 18 19; U6 2 4 5 6 8 9 10 11 12 17 18 19; U7 2 4 5 6 8 9 10 11 12 17 18 19

## Via types
v1: diameter 0.762, hole 0.305, Top Layer to Bottom Layer, 15 vias
v2: diameter 1.524, hole 0.914, Top Layer to Bottom Layer, 1 via

## Routing (per net, layer and track width the routed paths; a pad name or vN(x,y) marks a point on that pad's centre or on a via; arc(x,y) is an arc through that point)
+VIN: length 13.2
  Top Layer w2.032: U10.1 U10.2 arc(3.85,73.55) 3.76,73.76 U8.1
+VIN4700: length 44.3
  Top Layer w0.381: 33.98,48.03 32.03,48.03 31.57,48.49 31.57,49.2 31.22,49.56 29.52,49.56 29.13,49.17 C1.2
  Top Layer w2.032: v2(18.59,46.84) 22.89,46.84 C3.1
  Bottom Layer w2.032: 11.69,73.46 18.59,66.55 v2(18.59,46.84)
+VIN4701: length 9.1
  Top Layer w0.508: U2.13 29.86,78.3 28.93,79.22 27.15,79.22 26.65,78.72 C10.2
-VIN: length 16.9
  Top Layer w0.381: 4.72,35.82 arc(4.71,35.81) 4.69,35.8
  Top Layer w2.032: 4.72,36.17 5.59,36.17 8.89,32.87 6.35,32.87 6.35,34.14 4.72,35.77 ; 4.72,36.17 4.72,35.77 ; 4.72,36.17 4.32,36.17 4.69,35.8 4.72,35.77 ; 4.72,36.17 U9.1
-VIN1: length 21
  Top Layer w0.254: U6.13 22.2,32 21.29,32.92 19.56,32.92 19.1,32.46 19.1,30.02 20.42,28.7 20.53,28.7
  Top Layer w2.032: C18.1 19.43,25.25 8.89,25.25
-VIN2: length 31.7
  Top Layer w0.254: U7.13 19.51,12.85 18.65,13.72 17.12,13.72 16.6,13.2 16.6,10.47 18.85,10.47 U7.15
  Top Layer w2.032: U11.3 6.35,16.15 14.94,7.57
GND: length 11.3
  Top Layer w0.381: U2.7 34.47,78.95 v1(33.82,78.3) ; U6.7 25.7,32.65 arc(25.51,32.19) v1(25.05,32) ; U1.7 37.1,48.68 arc(36.91,48.22) v1(36.45,48.03) ; U7.7 23.06,13.5 arc(22.86,13.04) U7.21
  vias: v1(23.98,33.07) v1(24,30.99) v1(26.08,33.07) v1(26.08,30.99) v1(32.79,79.27) v1(32.79,77.34) v1(34.83,79.22) v1(34.83,77.34) v1(35.44,49) v1(35.43,47.07) v1(37.47,49) v1(37.47,47.07)
0P1V: length 24.6
  Top Layer w0.381: U4.1 16.31,50.5 31.24,50.5 32.08,49.66 32.08,49.12 32.52,48.68 U1.12
0P1V1: length 15.8
  Top Layer w0.508: U5.1 19.48,85.67 25.22,79.93 29.24,79.93 30.22,78.95 U2.12
0P2V: length 24.1
  Top Layer w0.381: U4.2 14.63,51.36 31.5,51.36 32.64,50.22 32.64,49.59 32.9,49.33 33.98,49.33
0P2V1: length 13
  Top Layer w0.508: U5.2 22.02,85.67 26.95,80.75 29.44,80.75 30.59,79.6 U2.11
0P4V: length 24.5
  Top Layer w0.381: U1.10 34.44,50.5 32.21,52.73 13.46,52.73 U4.3
0P4V1: length 11.5
  Top Layer w0.508: U2.10 32.52,81.38 31.93,81.97 28.22,81.97 24.56,85.62 U5.3
0P8V: length 26.1
  Top Layer w0.381: U1.9 35.79,50.51 35.79,51.05 32.08,54.76 12.96,54.76 U4.4
0P8V1: length 10
  Top Layer w0.508: U2.9 33.17,82.05 32.44,82.78 30,82.78 27.1,85.67 U5.4
1P6V: length 27.4
  Top Layer w0.381: U1.8 36.45,51.49 31.45,56.49 U4.5
1P6V1: length 8.2
  Top Layer w0.508: U5.5 29.75,86.69 29.75,85.67 31.68,83.74 32.39,83.74 33.82,82.32 U2.8
3P2V: length 29.9
  Top Layer w0.381: U1.6 37.75,51.76 31.4,58.12 13.06,58.12 U4.6
3P2V1: length 7.2
  Top Layer w0.508: U2.6 35.12,82.94 32.18,85.88 U5.6
6P4V1.0: length 9.4
  Top Layer w0.508: U2.5 37.06,79.6 37.57,80.1 37.57,82.83 34.72,85.67 U5.7
6P4V1.1: length 9.7
  Top Layer w0.508: U2.4 37.44,78.95 38.13,79.63 38.13,79.86 38.18,79.85 38.18,84.76 37.26,85.67 U5.8
6P4V.0: length 34.4
  Top Layer w0.381: U4.7 13.11,60.6 30.48,60.6 39.57,51.52 39.57,49.33 38.92,49.33
6P4V.1: length 37.7
  Top Layer w0.381: U1.4 39.79,48.68 40.21,49.1 40.21,52.4 29.57,63.04 13.21,63.04 U4.8
+VOUT1: length 154.1
  Top Layer w0.381: 38.92,46.73 39.67,46.73 39.91,46.97 39.91,47.78 39.65,48.03 38.92,48.03
  Top Layer w2.032: 71.32,47.95 71.32,34.03 U16.1 71.27,26.15 arc(71.18,25.69) 70.92,25.3 67.47,21.84 48.96,21.84 46.93,23.88 46.93,25.3 46.94,25.31 U12.1 46.94,35.71 48.26,37.03 57.36,37.03 58.78,35.61 58.78,33.99 ; 71.32,47.95 CN6.1 71.29,49.89 CN5.1 71.29,59.91 73.36,61.98 78.95,61.98 80.39,60.53 CN7.1 80.39,49.89 CN8.1 ; 71.32,47.95 69.9,46.53 63.65,46.53 62.22,47.96 CN4.1 62.2,49.89 CN3.1 62.2,59.62 60.66,61.16 54.04,61.16 53.11,60.23 CN1.1 arc(53.12,58.31) 53.13,58.3 CN2.1
+VOUT2: length 256.3
  Top Layer w0.508: C16.1 41.23,78.61 41.28,78.66 U3.3 ; R3.1 43.48,71.13 45.19,69.42 SW1.2
  Top Layer w2.032: 92.86,77.83 92.76,52.32 80.01,39.57 80.01,23.62 72.34,15.95 U19.1 71.83,14.28 U21.1 71.83,2.9 70.97,2.03 49.28,2.03 46.89,4.42 U20.1 arc(46.97,5.6) 46.99,5.73 U17.1 46.99,17.32 47.91,18.24 57.69,18.24 59.39,16.54 59.39,14.68 U18.1 ; 92.86,77.83 92.86,88.39 92.92,88.44 92.05,89.31 85.04,89.31 83.77,88.03 CN13.1 83.77,76.56 CN14.1 83.82,74.77 82.55,73.51 76.05,73.51 74.72,74.83 CN12.1 74.67,76.56 CN11.1 74.67,88.7 73.61,89.76 66.66,89.76 65.58,88.68 CN9.1 65.58,76.56 CN10.1 ; 92.86,77.83 92.86,76.56 92.91,76.5
  Bottom Layer w2.032: CN10.1 63.24,74.12 49.94,74.12 48.19,75.87 U3.3
-VOUT1: length 121.1
  Top Layer w2.032: C24.1 37.49,22.38 R7.3 R7.2 31.65,30.28 31.6,30.33
  Bottom Layer w2.032: 76.2,37.24 84.71,37.24 CN17.1 84.76,23.83 84.86,23.72 ; R7.2 39.12,30.28 45.82,36.98 50.84,36.98 52.02,35.8 52.02,25.31 U14.3 52.01,23.18 53.3,21.89 74.73,21.89 76,23.17 U15.3 76,33.63 76.35,33.98 76.35,36.02 75.29,37.08 65.03,37.08 63.86,35.92 63.86,33.98
-VOUT2: length 115
  Top Layer w2.032: R12.2 R12.3 ; 39.73,11.18 39.73,10.77 36.4,7.44 C31.1 30.44,9.11 C30.1
  Bottom Layer w2.032: 65.4,14.68 65.4,16.9 64.16,18.14 55.37,18.14 U17.3 52.07,11.08 ; 52.07,11.08 51.37,11.79 R12.3 ; 52.07,11.08 52.07,5.59 U20.3 51.97,4.06 54,2.03 74.02,2.03 77.42,5.44 U19.3 79.3,16.66 CN20.1 CN22.1 84.15,3.4 arc(84.16,3.37) CN21.1
$1N1706: length 3.9
  Top Layer w0.381: C4.1 31.17,47.38 U1.14
$1N2508: length 2.6
  Top Layer w0.381: LED1.2 48.16,44.57 arc(48.14,44.59) R2.2
$1N3698: length 3.4
  Top Layer w0.508: U2.14 27.94,77.65
$1N3720: length 2.5
  Top Layer w0.508: 47.95,74.19 45.49,74.19 arc(45.48,74.19) R3.2
$1N4132: length 7.9
  Top Layer w0.508: R5.2 R5.3 58.45,88.23 R4.1
$1N4373: length 21.1
  Top Layer w0.508: U3.1 U3.2 40.56,86.28 39.04,84.76 39.04,78.97 38.37,78.3 U2.3
$1N4467: length 27.9
  Top Layer w0.508: R5.1 53.85,93.32 53.75,93.22 ; 53.75,93.22 52.35,91.82 52.35,80.29 U3.4 ; 53.75,93.22 R6.2 ; 53.75,93.22 54.43,92.54 C17.1
$1N5088: length 2
  Top Layer w0.508: C21.2 22.54,31.34 arc(22.56,31.34) U6.14
$1N5429: length 7.7
  Top Layer w2.032: R7.1 37.47,32.8 C22.1
$1N6091: length 2.1
  Top Layer w0.381: C28.2 19.93,12.19 U7.14
$1N6218: length 4.3
  Top Layer w2.032: R11.2 35.78,11.74 arc(35.85,11.75) R12.1
$1N6336: length 10
  Top Layer w2.032: LED3.1 33.04,21.28 33.23,21.47 C23.2
$1N8256: length 20.1
  Top Layer w0.508: C17.2 54.43,81.71 55.65,80.49 R4.2 R4.3 58.45,73.94 SW1.1

## Copper pours and planes (outline as drawn; the poured copper is in the pictures)
+VIN on Top Layer: 1.07,87.02 7.01,87.02 7.01,71.33 1.07,71.33
+VIN4700 on Top Layer: 16.61,48.51 24.53,48.51 24.53,45.62 16.61,45.62
+VIN4700 on Top Layer: 22.84,47.96 35.38,47.96 35.38,44.2 22.84,44.2
+VIN4700 on Bottom Layer: 10.42,74.47 21.09,74.47 21.09,45.62 10.42,45.62
+VIN4701 on Top Layer: 20.5,77.6 32.7,77.6 32.7,73.84 20.5,73.84
+VIN4701 on Top Layer: 30.43,77.23 32.7,77.23 32.7,75.21 30.43,75.21
+VIN4701 on Top Layer: 10.54,77.37 22.86,77.37 22.86,74.03 10.54,74.03
-VIN on Top Layer: 1.78,43.03 9.7,43.03 9.7,32.61 1.78,32.61
-VIN1 on Top Layer: 20.12,25.25 26.94,25.25 26.94,23.64 20.12,23.64
-VIN1 on Top Layer: 21.9,30.89 23.88,30.89 23.88,28.96 21.9,28.96
-VIN1 on Top Layer: 7.97,28.65 20.94,28.65 20.94,23.74 7.97,23.74
-VIN1 on Top Layer: 21.93,28.27 27.11,28.27 27.11,23.77 21.93,23.77
-VIN1 on Top Layer: 20.12,30.7 23.75,30.7 23.75,24.9 20.12,24.9
-VIN2 on Top Layer: 14.91,10.62 21.15,10.62 21.15,6.2 14.91,6.2
-VIN2 on Top Layer: 5.24,17.12 15.6,17.12 15.6,6.45 5.24,6.45
-VIN2 on Top Layer: 18.97,11.55 21.41,11.55 21.41,4.04 18.97,4.04
-VIN2 on Top Layer: 19.27,11.69 21.29,11.69 21.29,9.65 19.27,9.65
-VIN2 on Top Layer: 4.93,26.57 7.67,26.57 7.67,14.83 4.93,14.83
GND on Top Layer: 33.99,83.01 34.66,83.01 34.66,80.77 33.99,80.77
GND on Top Layer: 29.82,71.98 42.28,71.98 42.28,68.73 29.82,68.73
GND on Top Layer: 20.27,72.85 31.25,72.85 31.25,68.74 20.27,68.74
GND on Top Layer: -1.78,98.65 99.52,98.65 99.52,-1.07 -1.78,-1.07
GND on Bottom Layer: -3.45,102.21 100.74,102.21 100.74,-2.69 -3.45,-2.69
6P4V.0 on Top Layer: 38.43,49.86 39.82,49.86 39.82,49.1 38.43,49.1
+VOUT1 on Top Layer: 37.55,49.36 46.86,49.36 46.86,42.54 37.55,42.54
+VOUT1 on Top Layer: 37.57,46.91 39.5,46.91 39.5,44.86 37.57,44.86
+VOUT1 on Top Layer: 41.4,50.85 54.08,50.85 54.08,48.97 41.4,48.97
+VOUT1 on Top Layer: 40.1,47.51 41.64,47.51 41.64,46.35 40.1,46.35
+VOUT2 on Top Layer: 34.9,77.18 36.81,77.18 36.81,75 34.9,75
+VOUT2 on Top Layer: 42.72,75.11 47.3,75.11 47.3,68.43 42.72,68.43
+VOUT2 on Top Layer: 39.98,79.3 49.13,79.3 49.13,76.08 39.98,76.08
+VOUT2 on Top Layer: 40.43,74.88 43.97,74.88 43.97,72.23 40.43,72.23
+VOUT2 on Top Layer: 34.9,79.37 42.15,79.37 42.15,72.23 34.9,72.23
-VOUT1 on Top Layer: 36.12,28.25 40.49,28.25 40.49,20.17 36.12,20.17
-VOUT1 on Top Layer: 26.16,30.89 28.29,30.89 28.29,28.96 26.16,28.96
-VOUT1 on Top Layer: 26.35,31.55 34.55,31.55 34.55,28.91 26.35,28.91
-VOUT2 on Top Layer: 25.79,12.65 28.6,12.65 28.6,7.84 25.79,7.84
-VOUT2 on Top Layer: 23.47,11.82 26.31,11.82 26.31,9.81 23.47,9.81
-VOUT2 on Top Layer: 25.23,12.6 26.49,12.6 26.49,11.73 25.23,11.73
$1N5429 on Top Layer: 27,33.45 30.53,33.45 30.53,31.82 27,31.82
$1N6070 on Top Layer: 24.38,13.93 26.98,13.93 26.98,12.65 24.38,12.65
$1N6070 on Top Layer: 26.37,14.58 30.59,14.58 30.59,13.28 26.37,13.28
$1N6070 on Top Layer: 28.75,14.58 30.18,14.58 30.18,10.92 28.75,10.92
$1N6336 on Top Layer: 31.96,28.09 34.78,28.09 34.78,20.78 31.96,20.78
$1N6350 on Top Layer: 25.91,6.81 32.51,6.81 32.51,0.46 25.91,0.46

Small or netless copper shapes (teardrops, artwork), in the pictures only: 2 on Top Layer

## Text on the board
Top Silkscreen Layer: 6.4V | 3.2V | 0.8V | 0.2V | 0.4V | 1.6V | 0.1V | +VOUT2  GND  -VOUT2 | +VOUT1 GND -VOUT1 | 0.1<+Vout1<20.5 | 1.4<+Vout2<34 | -VOUT1 | -VOUT2 | 当下面开关接通时，表示只可拨码 / 开关调试电压最大电压34V输 / 入电压至少大于其2v | 当上面开关接通时，表示FB / 和拨码开关均可以
